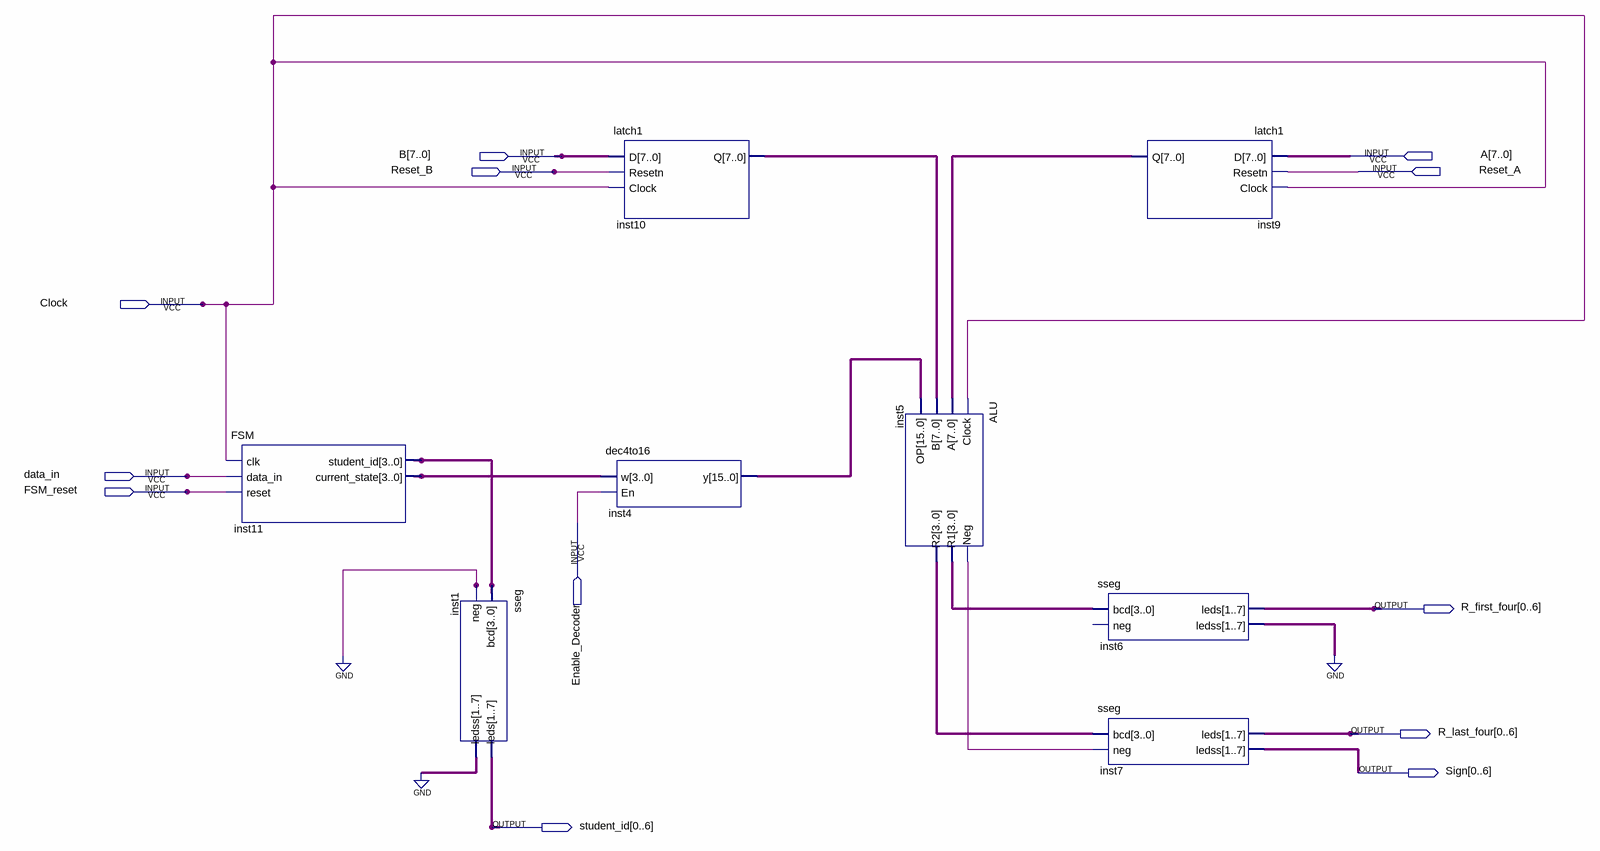
[diagram p0: schematic sheet]
// Quartus schematic DiagramA.bdf as structural Verilog: 8 symbols, 12 pins
module DiagramA (
  input  [7:0] B,
  input  [7:0] A,
  input  Reset_B,
  input  Reset_A,
  input  Clock,
  input  data_in,
  input  FSM_reset,
  input  Enable_Decoder,
  output [0:6] R_first_four,
  output [0:6] R_last_four,
  output [0:6] Sign,
  output [0:6] student_id
);

  wire inst5_neg;
  wire [3:0] inst5_r1, inst5_r2, inst11_current_state, inst11_student_id;
  wire [6:0] inst1_ledss, inst6_ledss;
  wire [7:0] inst9_q, inst10_q;
  wire [15:0] inst4_y;

  FSM inst11 (
    .clk(Clock), .data_in(data_in), .reset(FSM_reset), .student_id(inst11_student_id),
    .current_state(inst11_current_state));
  sseg inst1 (.bcd(inst11_student_id), .neg(1'b0), .leds(student_id), .ledss(inst1_ledss));
  latch1 inst10 (.D(B), .Resetn(Reset_B), .Clock(Clock), .Q(inst10_q));
  dec4to16 inst4 (.w(inst11_current_state), .En(Enable_Decoder), .y(inst4_y));
  ALU inst5 (.Clock(Clock), .A(inst9_q), .B(inst10_q), .OP(inst4_y), .Neg(inst5_neg), .R1(inst5_r1), .R2(inst5_r2));
  sseg inst6 (.bcd(inst5_r1), .leds(R_first_four), .ledss(inst6_ledss));  // open: neg
  sseg inst7 (.bcd(inst5_r2), .neg(inst5_neg), .leds(R_last_four), .ledss(Sign));
  latch1 inst9 (.D(A), .Resetn(Reset_A), .Clock(Clock), .Q(inst9_q));
  // also tied to GND on the sheet: {inst1_ledss[0], inst1_ledss[1], inst1_ledss[2], inst1_ledss[3], inst1_ledss[4], inst1_ledss[5], inst1_ledss[6], inst6_ledss[0], inst6_ledss[1], inst6_ledss[2], inst6_ledss[3], inst6_ledss[4], inst6_ledss[5], inst6_ledss[6]}
endmodule
